# Altium schematic sheet lib.SchDoc
size A4
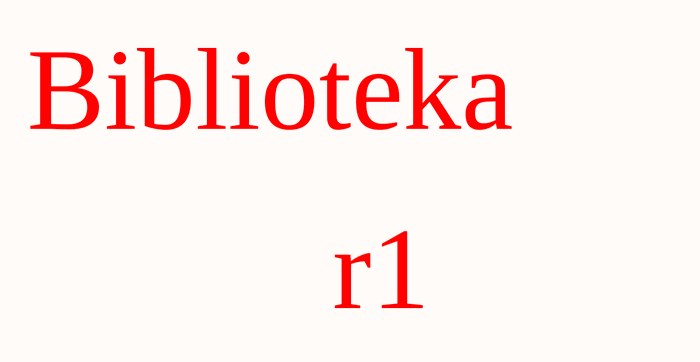
[diagram p0: lib.SchDoc]

## Notes on the sheet
- Biblioteka
- r1